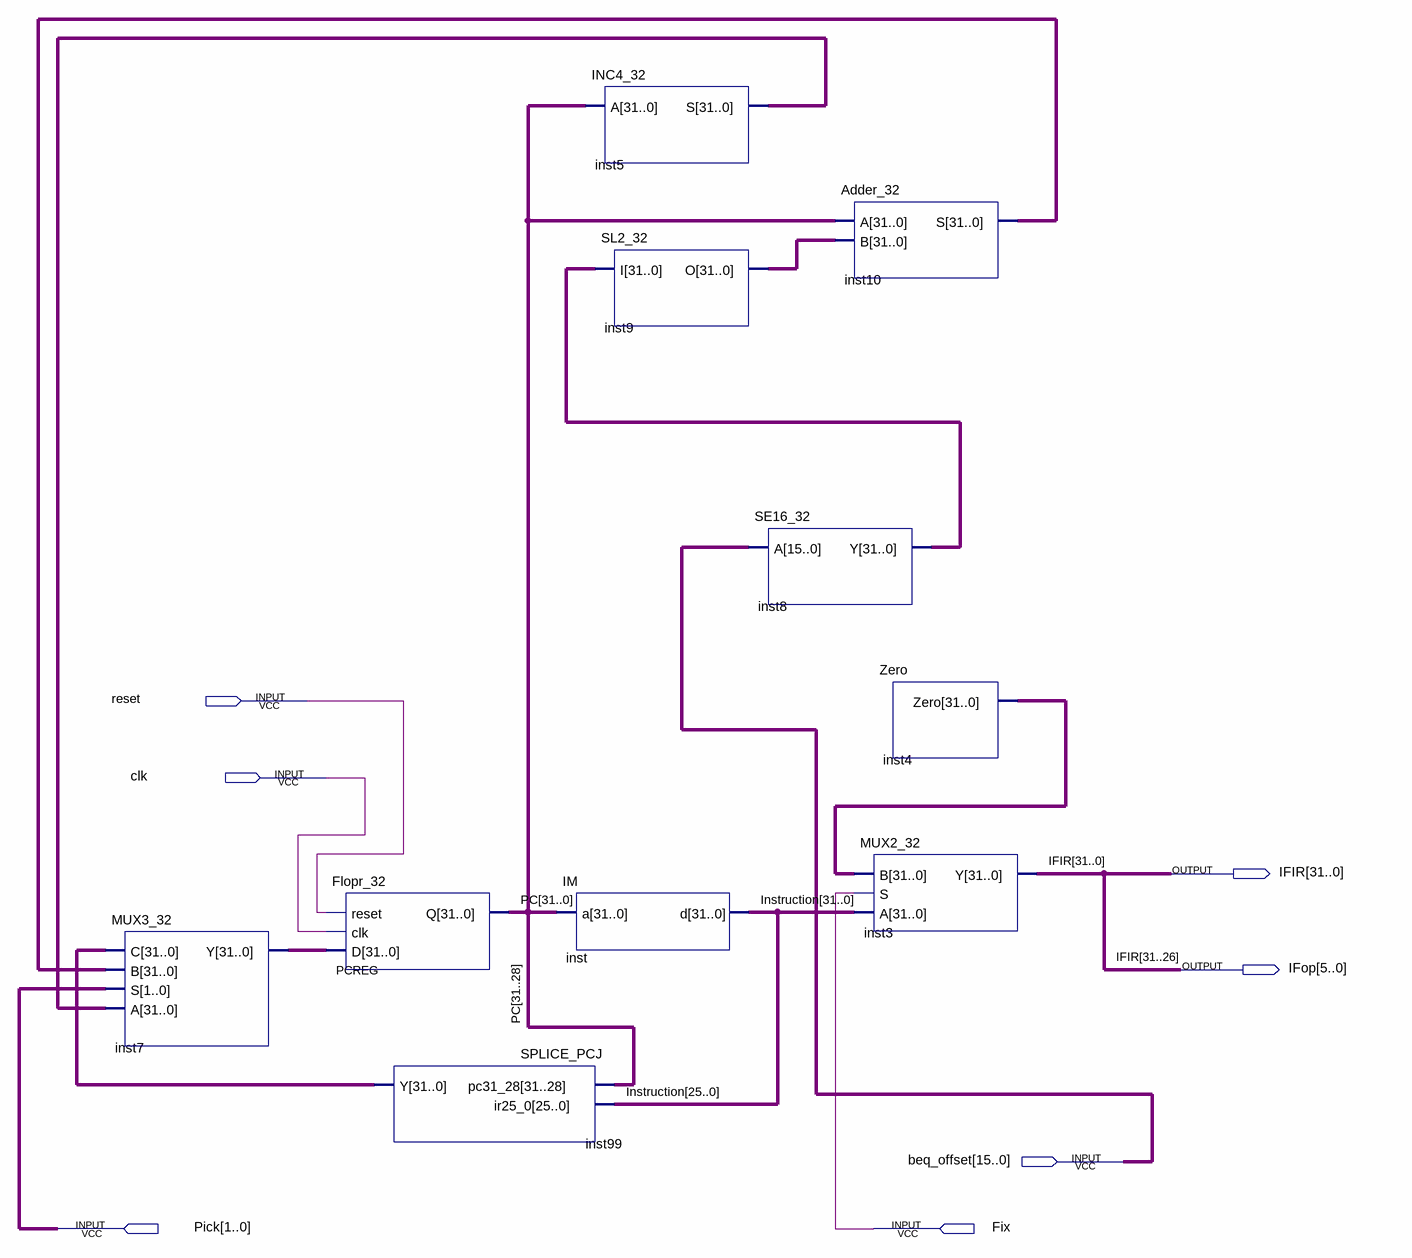
[diagram p0: schematic sheet]
// Quartus schematic IF.bdf as structural Verilog: 10 symbols, 7 pins
module IF (
  input  reset,
  input  clk,
  input  [15:0] beq_offset,
  input  [1:0] Pick,
  input  Fix,
  output [31:0] IFIR,
  output [5:0] IFop
);

  wire [31:0] inst4_zero, inst5_s, inst7_y, inst8_y, inst9_o, inst10_s, inst99_y, Instruction, PC;

  MUX3_32 inst7 (.C(inst99_y), .B(inst10_s), .S(Pick), .A(inst5_s), .Y(inst7_y));
  Flopr_32 PCREG (.reset(reset), .clk(clk), .D(inst7_y), .Q(PC));
  SPLICE_PCJ inst99 (.pc31_28(PC[31:28]), .ir25_0(Instruction[25:0]), .Y(inst99_y));
  IM inst (.a(PC), .d(Instruction));
  INC4_32 inst5 (.A(PC), .S(inst5_s));
  SL2_32 inst9 (.I(inst8_y), .O(inst9_o));
  SE16_32 inst8 (.A(beq_offset), .Y(inst8_y));
  Adder_32 inst10 (.A(PC), .B(inst9_o), .S(inst10_s));
  Zero inst4 (.Zero(inst4_zero));
  MUX2_32 inst3 (.B(inst4_zero), .S(Fix), .A(Instruction), .Y(IFIR));

  assign IFop = IFIR[31:26];
endmodule
